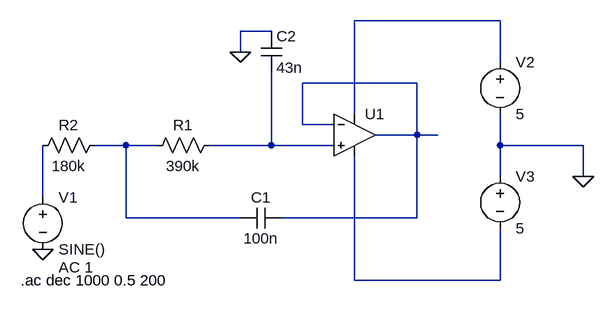
[diagram p0: schematic spo2lowpassfilter.asc]
spo2lowpassfilter.asc, the LTspice schematic file:
Version 4
SHEET 1 880 680
WIRE 448 -16 224 -16
WIRE 96 0 48 0
WIRE 48 32 48 0
WIRE 448 48 448 -16
WIRE 320 80 144 80
WIRE 224 128 224 -16
WIRE 144 144 144 80
WIRE 192 144 144 144
WIRE 320 160 320 80
WIRE 320 160 256 160
WIRE 352 160 320 160
WIRE -128 176 -176 176
WIRE -80 176 -128 176
WIRE 96 176 96 64
WIRE 96 176 0 176
WIRE 192 176 96 176
WIRE 448 176 448 128
WIRE 576 176 448 176
WIRE 448 224 448 176
WIRE 576 224 576 176
WIRE -256 256 -256 176
WIRE -128 288 -128 176
WIRE 48 288 -128 288
WIRE 320 288 320 160
WIRE 320 288 112 288
WIRE 224 384 224 192
WIRE 448 384 448 304
WIRE 448 384 224 384
FLAG 48 32 0
FLAG -256 336 0
FLAG 576 224 0
SYMBOL OpAmps\\UniversalOpAmp 224 160 R0
SYMATTR InstName U1
SYMBOL cap 80 0 R0
SYMATTR InstName C2
SYMATTR Value 43n
SYMBOL res -96 192 R270
WINDOW 0 32 56 VTop 2
WINDOW 3 0 56 VBottom 2
SYMATTR InstName R1
SYMATTR Value 390k
SYMBOL res -272 192 R270
WINDOW 0 32 56 VTop 2
WINDOW 3 0 56 VBottom 2
SYMATTR InstName R2
SYMATTR Value 180k
SYMBOL voltage -256 240 R0
WINDOW 123 24 124 Left 2
WINDOW 39 0 0 Left 0
SYMATTR InstName V1
SYMATTR Value SINE()
SYMATTR Value2 AC 1
SYMBOL voltage 448 32 R0
SYMATTR InstName V2
SYMATTR Value 5
SYMBOL voltage 448 208 R0
SYMATTR InstName V3
SYMATTR Value 5
SYMBOL cap 48 304 R270
WINDOW 0 32 32 VTop 2
WINDOW 3 0 32 VBottom 2
SYMATTR InstName C1
SYMATTR Value 100n
TEXT -290 384 Left 2 !.ac dec 1000 0.5 200

The netlist it stands for:
* spo2lowpassfilter.asc
XU1 N004 N002 N001 N006 N002 level1 Avol=1Meg GBW=10Meg Vos=0 En=0 Enk=0 In=0 Ink=0 Rin=500Meg  ; pins In+ In- V+ V- OUT
C2 0 N004 43n
R1 N003 N004 390k
R2 N005 N003 180k
V1 N005 0 SINE() AC 1
V2 N001 0 5
V3 0 N006 5
C1 N003 N002 100n
.ac dec 1000 0.5 200
.lib UniversalOpAmp1.lib
.backanno
.end